# Altium project Laser-Cueing.PrjPcb
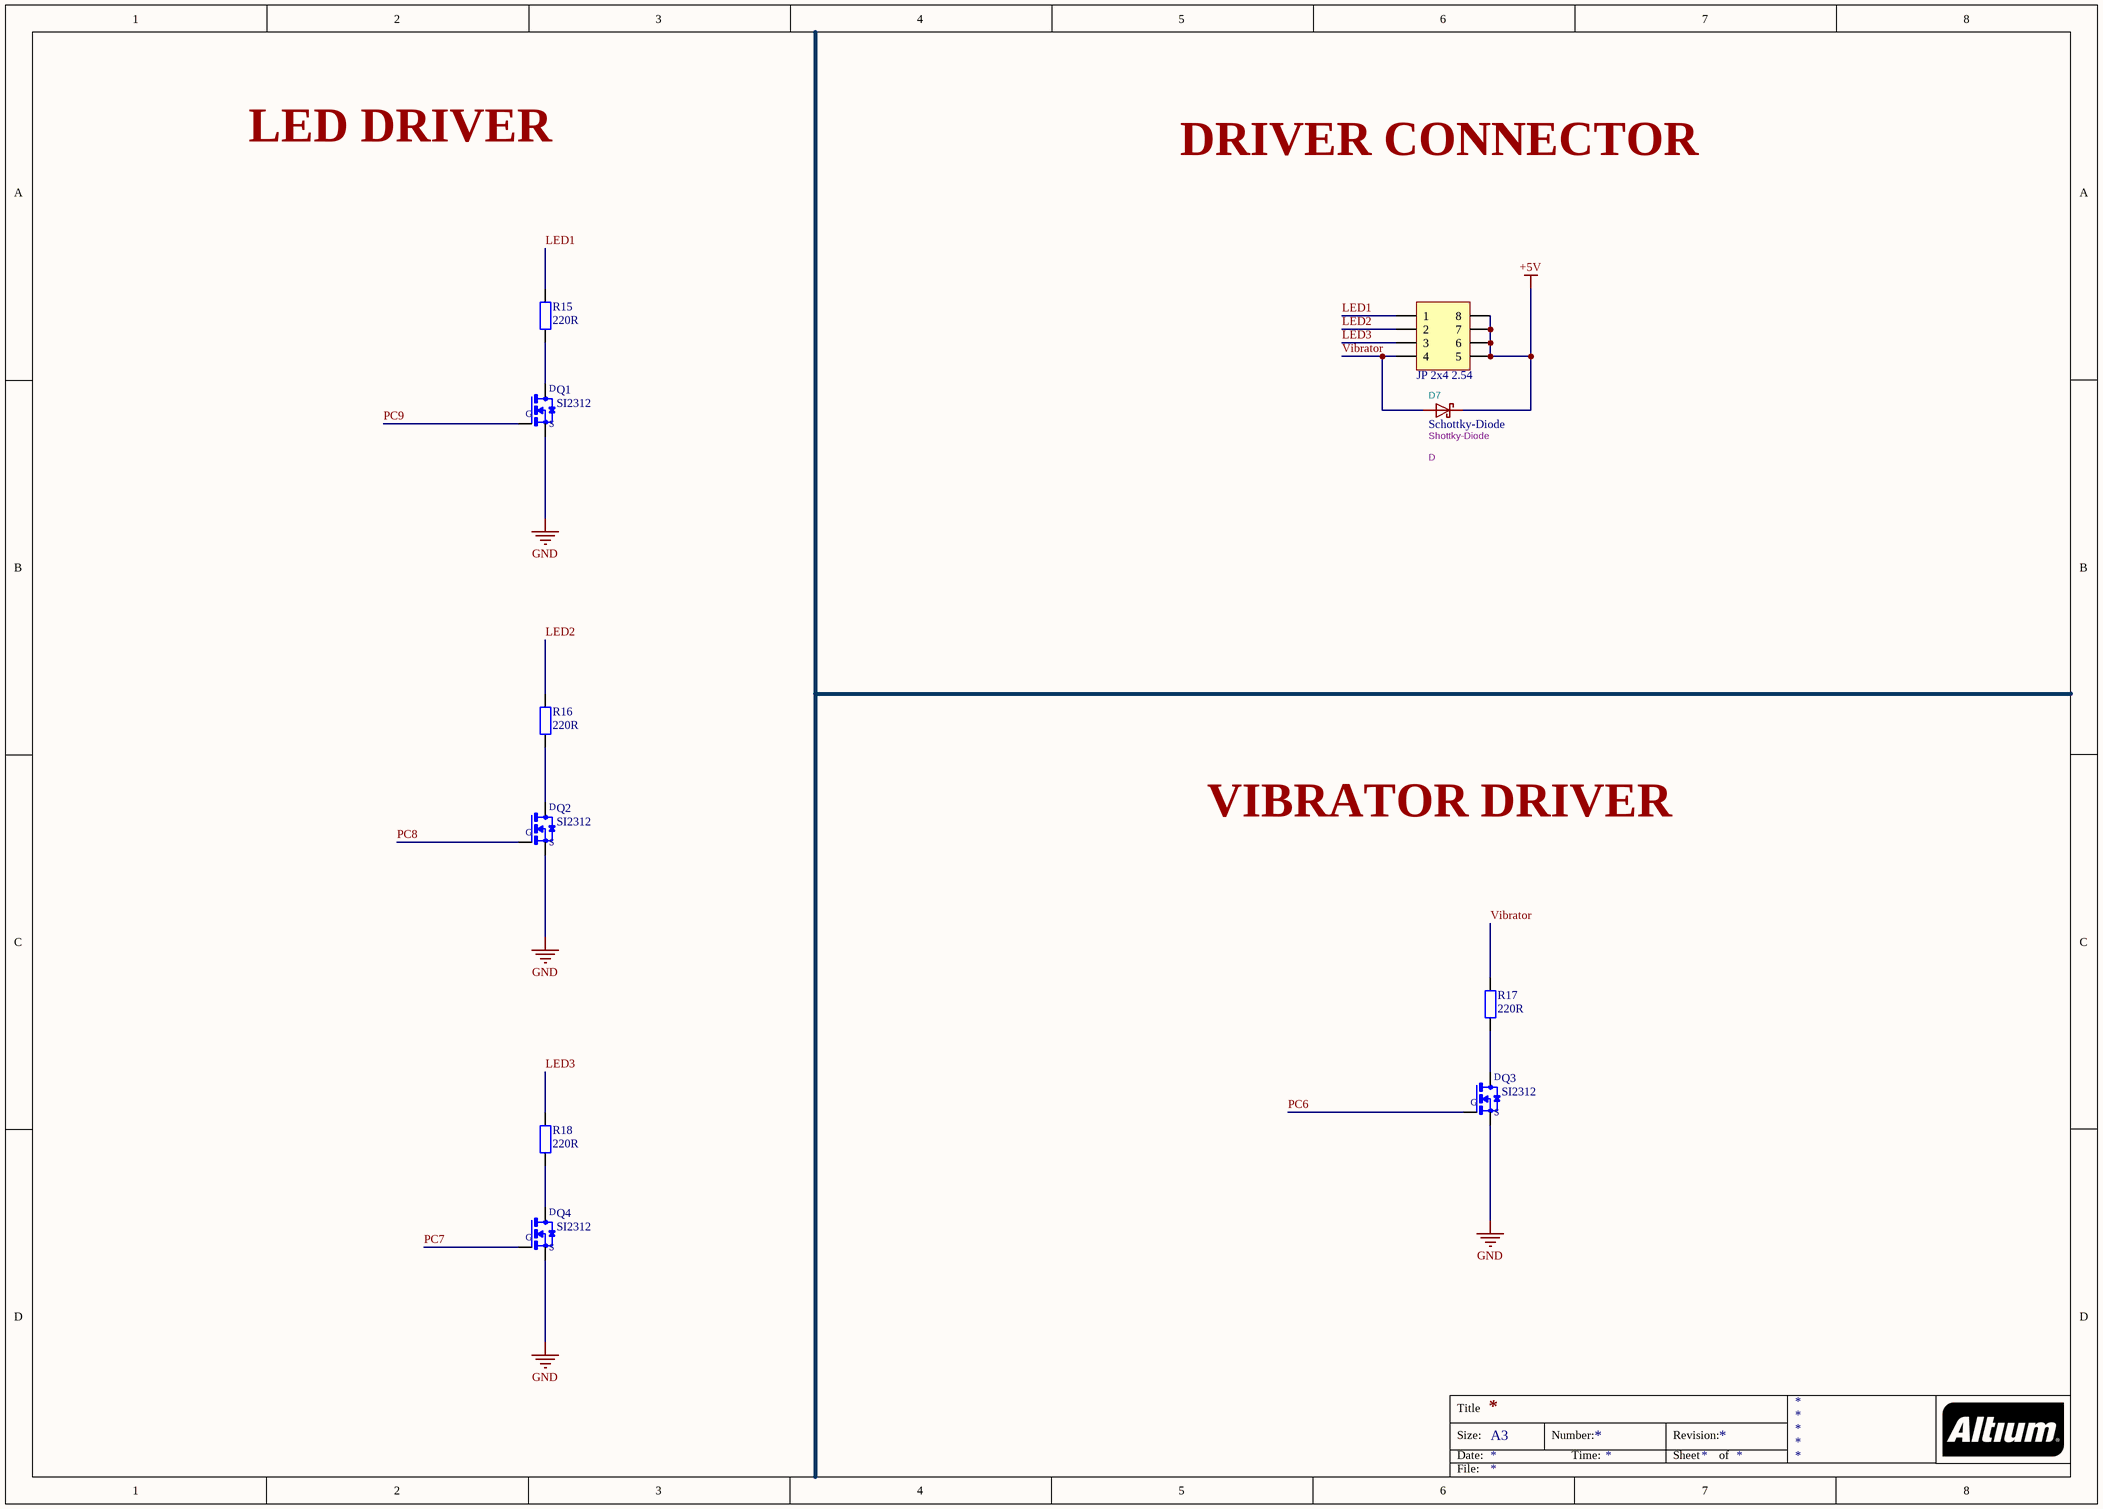
[diagram p0: Driver.SchDoc]
4 sheets, 63 parts. Net scope: global (net labels, ports and power ports of the same name join across sheets).
Board file: 06042024_LaserCueing.PcbDoc
Sheets:
  Driver.SchDoc
  ADC.SchDoc
  Peripherial.SchDoc
  PWR_SRC.SchDoc

## Sheet Driver.SchDoc
size A3

### Parts
D7  Schottky-Diode  value Shottky-Diode  Reference: D  [SOD-80_MiniMELF_Glass]
Driver1  JP 2x4 2.54  [JP 2x4 DT]
Q1  SI2312  [SOT23]
Q2  SI2312  [SOT23]
Q3  SI2312  [SOT23]
Q4  SI2312  [SOT23]
R15  220R  [tro smd 0603]
R16  220R  [tro smd 0603]
R17  220R  [tro smd 0603]
R18  220R  [tro smd 0603]

### Nets
+5V: D7.K Driver1.5 Driver1.6 Driver1.7 Driver1.8
GND: Q1.2(S) Q2.2(S) Q3.2(S) Q4.2(S)
LED1: Driver1.1 R15.2
LED2: Driver1.2 R16.2
LED3: Driver1.3 R18.2
PC6: Q3.1(G)
PC7: Q4.1(G)
PC8: Q2.1(G)
PC9: Q1.1(G)
Vibrator: D7.A Driver1.4 R17.2
NetQ1_3: Q1.3(D) R15.1
NetQ2_3: Q2.3(D) R16.1
NetQ3_3: Q3.3(D) R17.1
NetQ4_3: Q4.3(D) R18.1

### Notes on the sheet
- LED DRIVER
- DRIVER CONNECTOR
- VIBRATOR DRIVER
- Title
- Size:
- Date:
- A3
- Number:
- Time:
- Revision:
- Sheet
- of
- File:

### Library data of the parts
D7 = Schottky-Diode: ki_description: Schottky Diode; Datasheet: https://diotec.com/de/produktliste/SBD.html; ki_keywords: Schottky
Driver1 = JP 2x4 2.54 Duc Thang: Cắm; Ten_Linh_Kien: Jump Đôi Đực 2.54MM 2x40P Thẳng 11MM; Don_Vi: Con; Ma_Hang: MH002686; Ghi_Chu: *; Kieu_Chan: *; Chung_Loai: Cắm
Q1-Q4 = SI2312: <b>N-Channel MOSFET</b>    <a href="https://pricing.snapeda.com/parts/SI2312/Micro%20Commercial%20Components/view-part?ref=eda">Check availability</a> <a href="https://pricing.snapeda.com/parts/SI2312/Micro%20Commercial%20Components/view-part?ref=eda">Check availability</a>; MF: {'manufacturer': u'Micro Commercial Components'}; MP: SI2312-TP; Package: None; Price: None; Value: *; Availability: Unavailable
R15-R18 = Tro 0603 5% 220R: Dán; Don_Vi: Con; So_Chan: 2; Ten_Linh_Kien: Trở 0603 5% 220R; Ma_Hang: MH006322; Chung_Loai: Dán; Kieu_Chan: *

## Sheet ADC.SchDoc
size A4
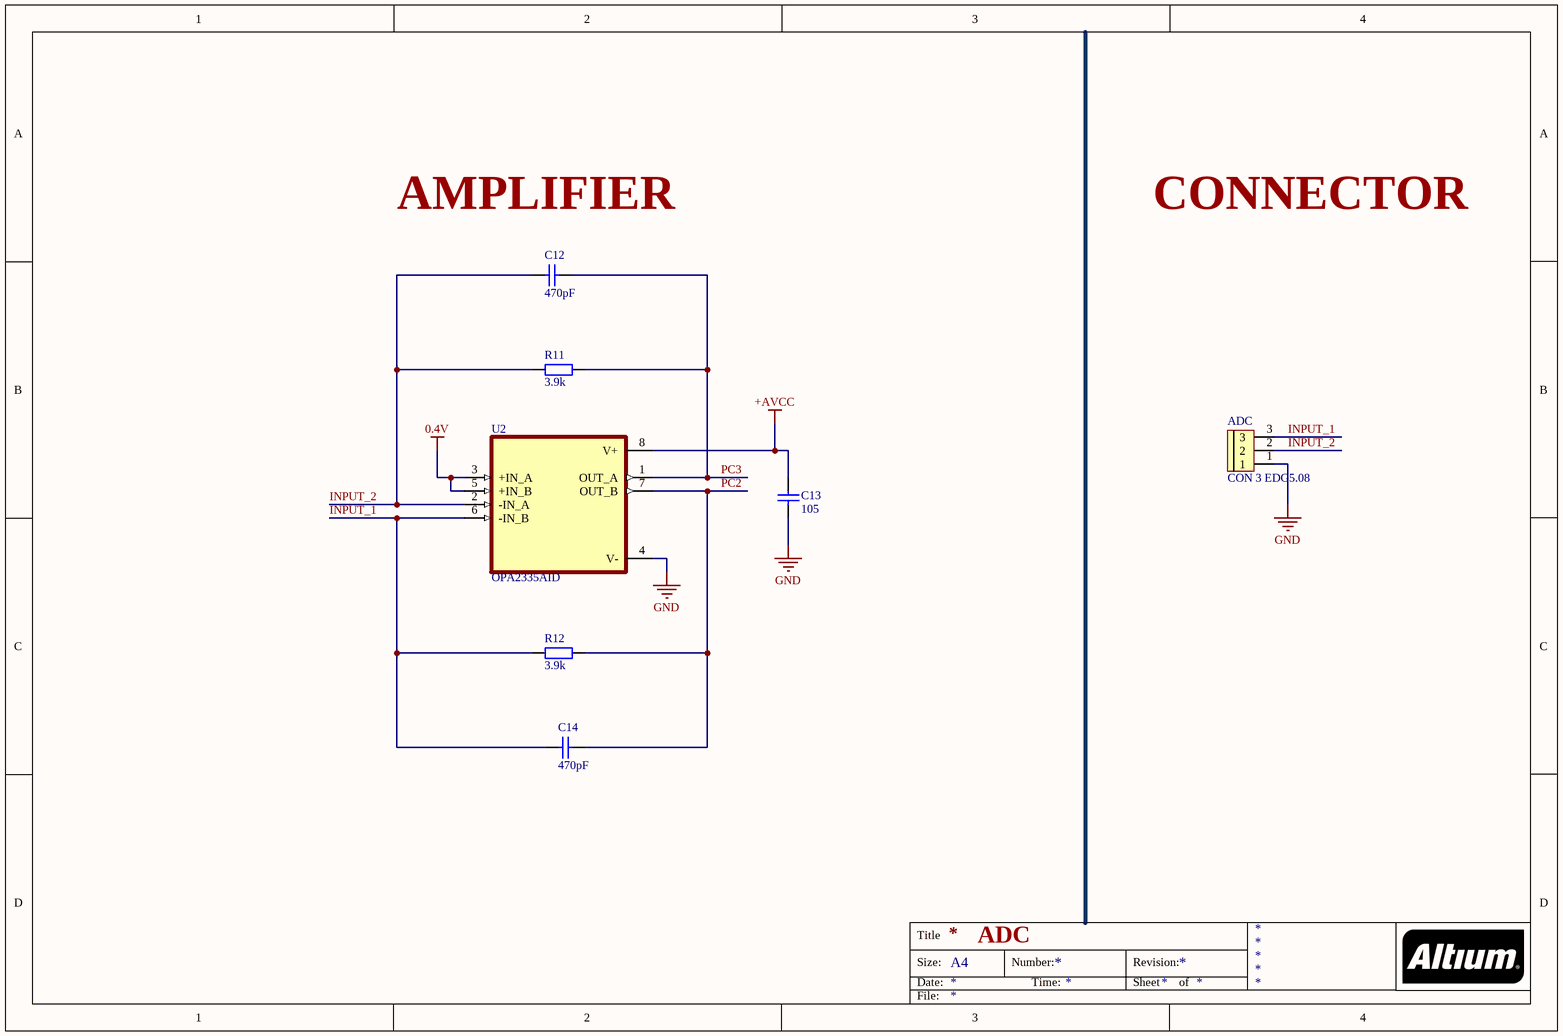
[diagram p1: ADC.SchDoc]

### Parts
ADC  CON 3 EDG5.08  [CON 3 3EDG5.08]
C12  470pF  [tu 0603]
C13  105  [tu 1206]
C14  470pF  [tu 0603]
R11  3.9k  [tro smd 0603]
R12  3.9k  [tro smd 0603]
U2  OPA2335AID  [SOIC127P599X175-8N]

### Nets
0.4V: U2.3(+IN_A) U2.5(+IN_B)
+AVCC: C13.1 U2.8(V+)
GND: ADC.1 C13.2 U2.4(V-)
INPUT_1: ADC.3 C14.2 R12.1 U2.6(-IN_B)
INPUT_2: ADC.2 C12.2 R11.1 U2.2(-IN_A)
PC2: C14.1 R12.2 U2.7(OUT_B)
PC3: C12.1 R11.2 U2.1(OUT_A)

### Notes on the sheet
- AMPLIFIER
- CONNECTOR
- ADC
- Title
- Size:
- Date:
- A4
- Number:
- Time:
- Revision:
- Sheet
- of
- File:

### Library data of the parts
ADC = CON 3 EDG5.08: Cắm; Ten_Linh_Kien: CON 3 2EDG5.08-3P 5.08MM ( Xanh Cong); Ma_Hang: MH000760; Ghi_Chu: *; Kieu_Chan: *; Don_Vi: Con; Chung_Loai: Cắm
C12 C14 = Tu 0603 470pF 50V 10%: Dán; Don_Vi: Con; So_Chan: 2; Ten_Linh_Kien: Tụ 0603 470P 50V 10%; Ma_Hang: MH004571; Chung_Loai: Dán; Kieu_Chan: *
C13 = Tu 1206 105 50V 20%: Dán; Don_Vi: Con; So_Chan: 2; Ten_Linh_Kien: Tụ 1206 105-1uF 20% 50V; Ma_Hang: MH004545; Chung_Loai: Dán; Kieu_Chan: *
R11 R12 = Tro 0603 1% 3.9k: Dán; So_Chan: 2; Ten_Linh_Kien: Trở 0603 1% 3.9k; Ma_Hang: MH005793; Don_Vi: Con; Chung_Loai: Dán; Kieu_Chan: *
U2 = OPA2335AID: MF: {'manufacturer': u'Texas Instruments'}; Package: None; Price: None; Value: *; MP: OPA2335AID; Availability: Unavailable

## Sheet Peripherial.SchDoc
size A3
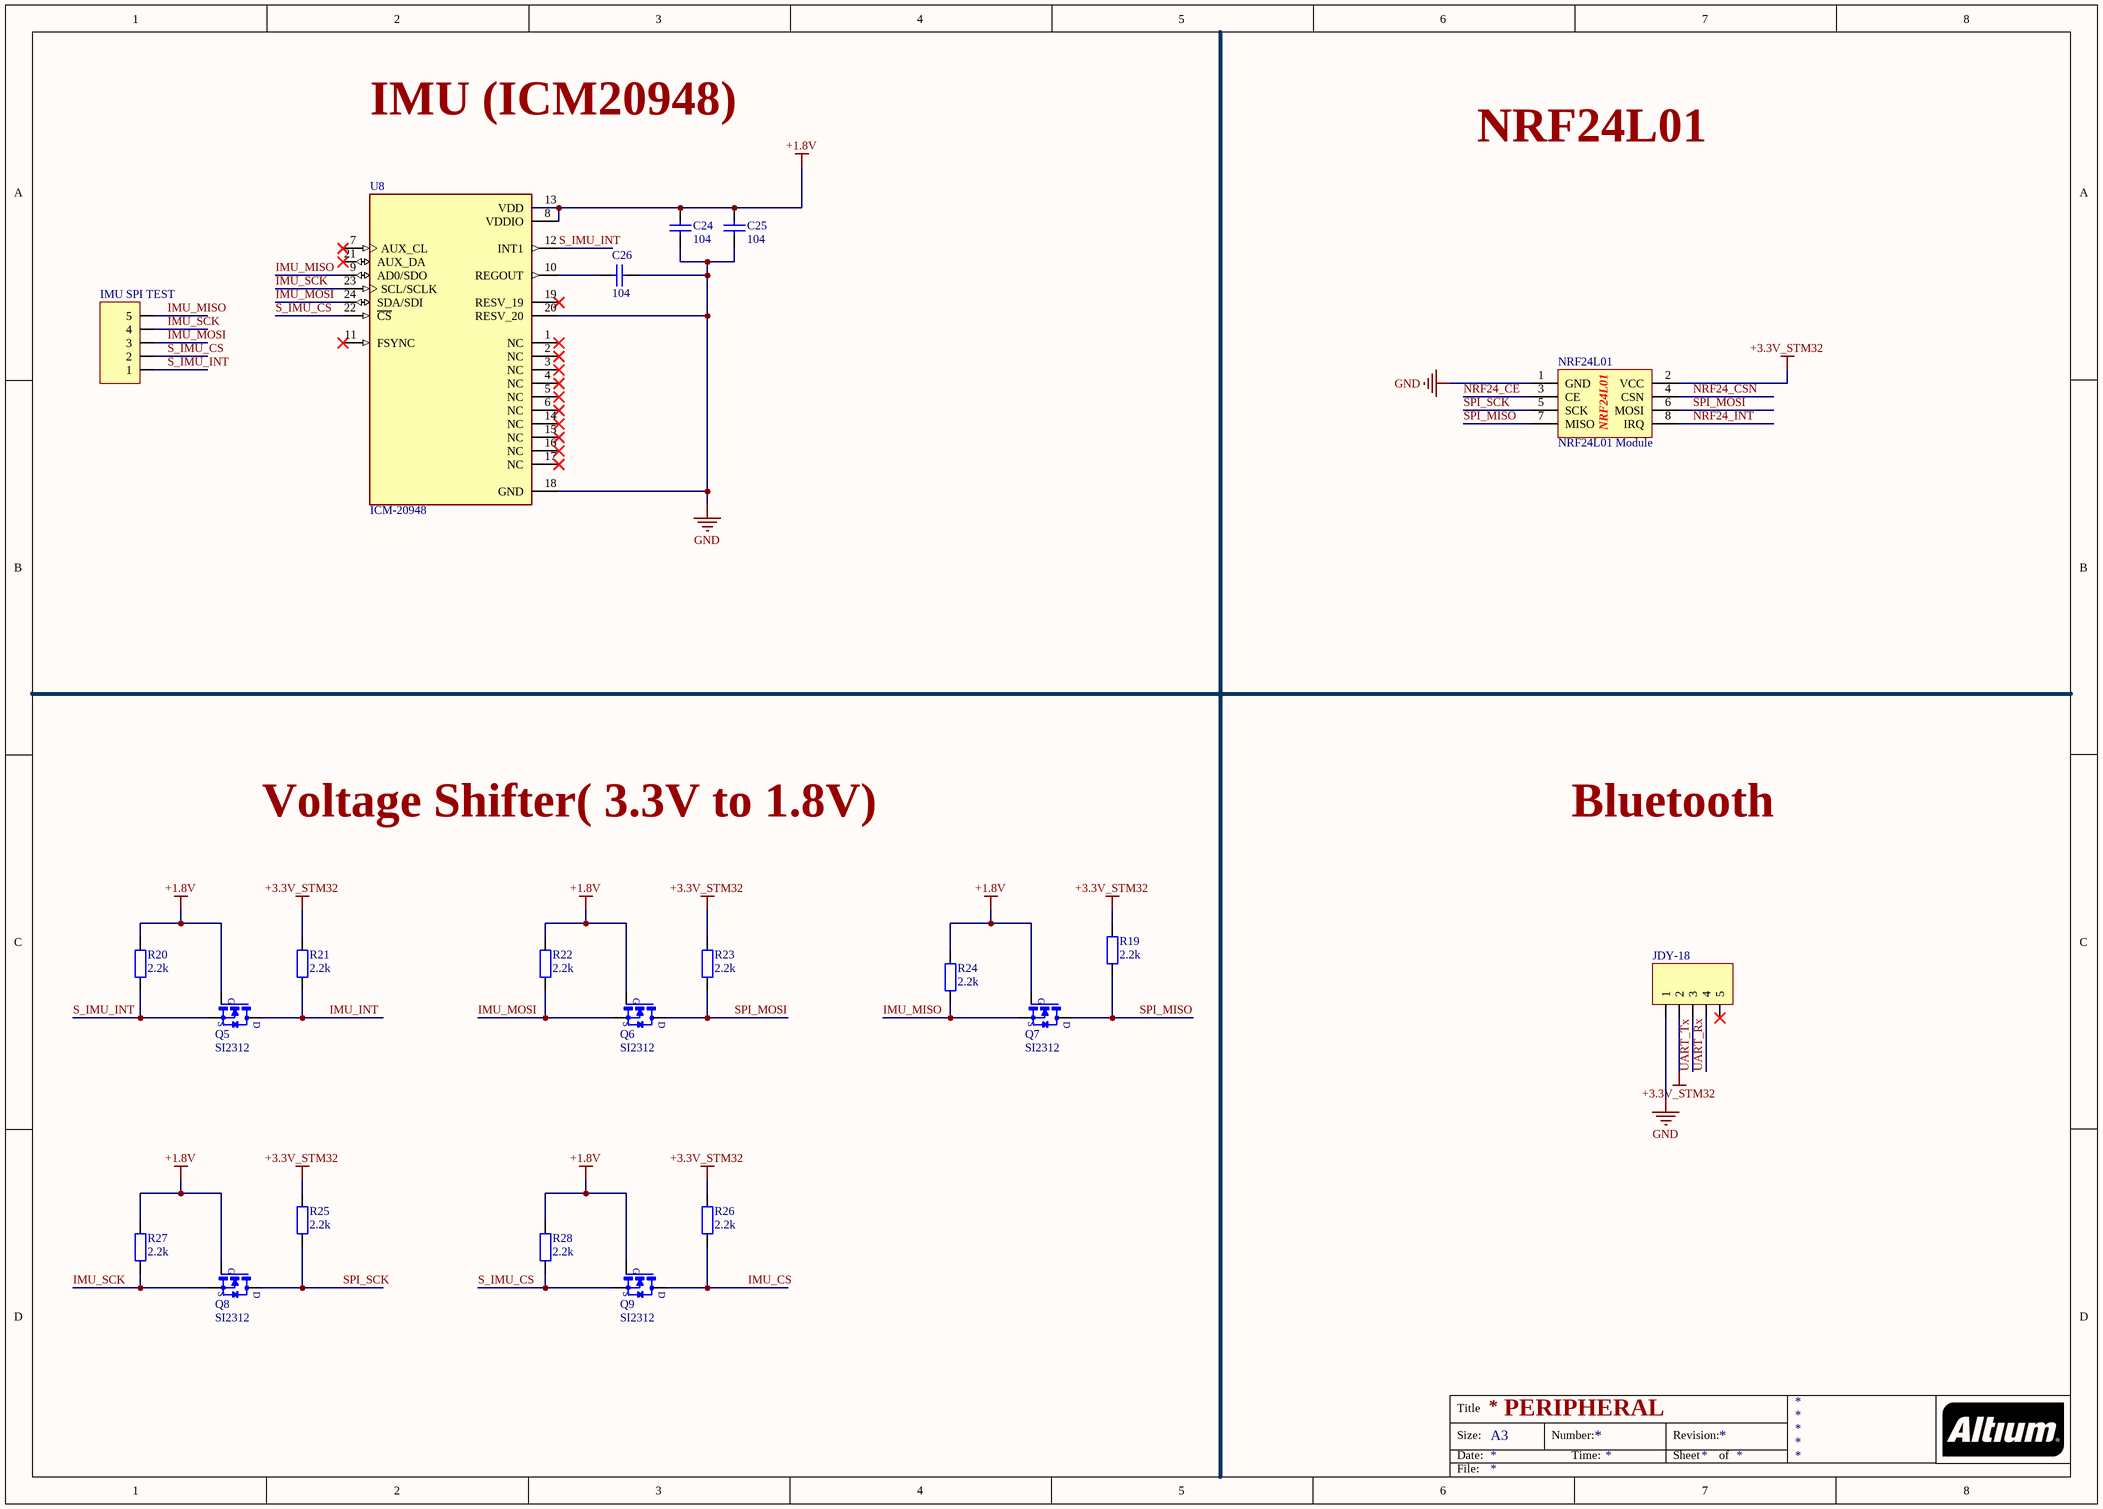
[diagram p2: Peripherial.SchDoc]

### Parts
C24  104  [tu 1206]
C25  104  [tu 1206]
C26  104  [tu 1206]
IMU_SPI_TEST  (no value)  [JP 1x5 DT]
JDY-18  JP 1x5 2.54  [JP 1x5 CC]  (value not drawn)
NRF24L01  NRF24L01 Module  [NRF24L01]
Q5  SI2312  [SOT23]
Q6  SI2312  [SOT23]
Q7  SI2312  [SOT23]
Q8  SI2312  [SOT23]
Q9  SI2312  [SOT23]
R19  2.2k  [tro smd 0603]
R20  2.2k  [tro smd 0603]
R21  2.2k  [tro smd 0603]
R22  2.2k  [tro smd 0603]
R23  2.2k  [tro smd 0603]
R24  2.2k  [tro smd 0603]
R25  2.2k  [tro smd 0603]
R26  2.2k  [tro smd 0603]
R27  2.2k  [tro smd 0603]
R28  2.2k  [tro smd 0603]
U8  ICM-20948  [QFN40P300X300X105-24N]

### Nets
+1.8V: C24.1 C25.1 Q5.1(G) Q6.1(G) Q7.1(G) Q8.1(G) Q9.1(G) R20.2 R22.2 R24.2 R27.2 R28.2 U8.8(VDDIO) U8.13(VDD)
+3.3V_STM32: JDY-18.2 NRF24L01.2(VCC) R19.2 R21.2 R23.2 R25.2 R26.2
GND: C24.2 C25.2 C26.2 JDY-18.1 NRF24L01.1(GND) U8.18(GND) U8.20(RESV_20)
IMU_CS: Q9.3(D) R26.1
IMU_INT: Q5.3(D) R21.1
IMU_MISO: IMU_SPI_TEST.5 Q7.2(S) R24.1 U8.9(AD0/SDO)
IMU_MOSI: IMU_SPI_TEST.3 Q6.2(S) R22.1 U8.24(SDA/SDI)
IMU_SCK: IMU_SPI_TEST.4 Q8.2(S) R27.1 U8.23(SCL/SCLK)
NRF24_CE: NRF24L01.3(CE)
NRF24_CSN: NRF24L01.4(CSN)
NRF24_INT: NRF24L01.8(IRQ)
S_IMU_CS: IMU_SPI_TEST.2 Q9.2(S) R28.1 U8.22(~{CS})
S_IMU_INT: IMU_SPI_TEST.1 Q5.2(S) R20.1 U8.12(INT1)
SPI_MISO: NRF24L01.7(MISO) Q7.3(D) R19.1
SPI_MOSI: NRF24L01.6(MOSI) Q6.3(D) R23.1
SPI_SCK: NRF24L01.5(SCK) Q8.3(D) R25.1
UART_Rx: JDY-18.4
UART_Tx: JDY-18.3
NetC26_1: C26.1 U8.10(REGOUT)

Not connected (* = marked no-connect by the designer): JDY-18 5*; U8 1(NC)* 2(NC)* 3(NC)* 4(NC)* 5(NC)* 6(NC)* 7(AUX_CL)* 11(FSYNC)* 14(NC)* 15(NC)* 16(NC)* 17(NC)* 19(RESV_19)* 21(AUX_DA)*

### Notes on the sheet
- IMU (ICM20948)
- NRF24L01
- Voltage Shifter( 3.3V to 1.8V)
- Bluetooth
- PERIPHERAL
- Title
- Size:
- Date:
- A3
- Number:
- Time:
- Revision:
- Sheet
- of
- File:

### Library data of the parts
C24-C26 = Tu 1206 104 50V 20%: Dán; Don_Vi: Con; So_Chan: 2; Ten_Linh_Kien: Tụ 1206 104-0.1uF 20% 50V; Ma_Hang: MH004544; Chung_Loai: Dán; Kieu_Chan: *
IMU_SPI_TEST = JP 1x5 2.54 Duc Thang: Cắm; Ten_Linh_Kien: Jump Đơn Đực 2.54MM 1x40P Thẳng 11MM; Don_Vi: Con; Ma_Hang: MH000903; Ghi_Chu: *; Kieu_Chan: *; Chung_Loai: Cắm
JDY-18 = JP 1x5 2.54 Cai Cong: Cắm; Ten_Linh_Kien: Jump Đơn Cái 2.54MM 1x40P Cong; Don_Vi: Con; Ma_Hang: MH001265; Ghi_Chu: *; Kieu_Chan: *; Chung_Loai: Cắm
Q5-Q9 = SI2312: as Q1 on sheet Driver; Package: None; Price: None; Value: *; Availability: Unavailable
R19-R28 = Tro 0603 5% 2.2k: Dán; Don_Vi: Con; So_Chan: 2; Ten_Linh_Kien: Trở 0603 5% 2.2k; Ma_Hang: MH006321; Chung_Loai: Dán; Kieu_Chan: *
U8 = ICM-20948: Accelerometer, Gyroscope, Magnetometer, 9 Axis Sensor IÂ²C, SPI Output; MF: {'manufacturer': u'TDK InvenSense'}; Package: None; Price: None; Value: *; MP: ICM-20948; Availability: Unavailable

## Sheet PWR_SRC.SchDoc
size A3
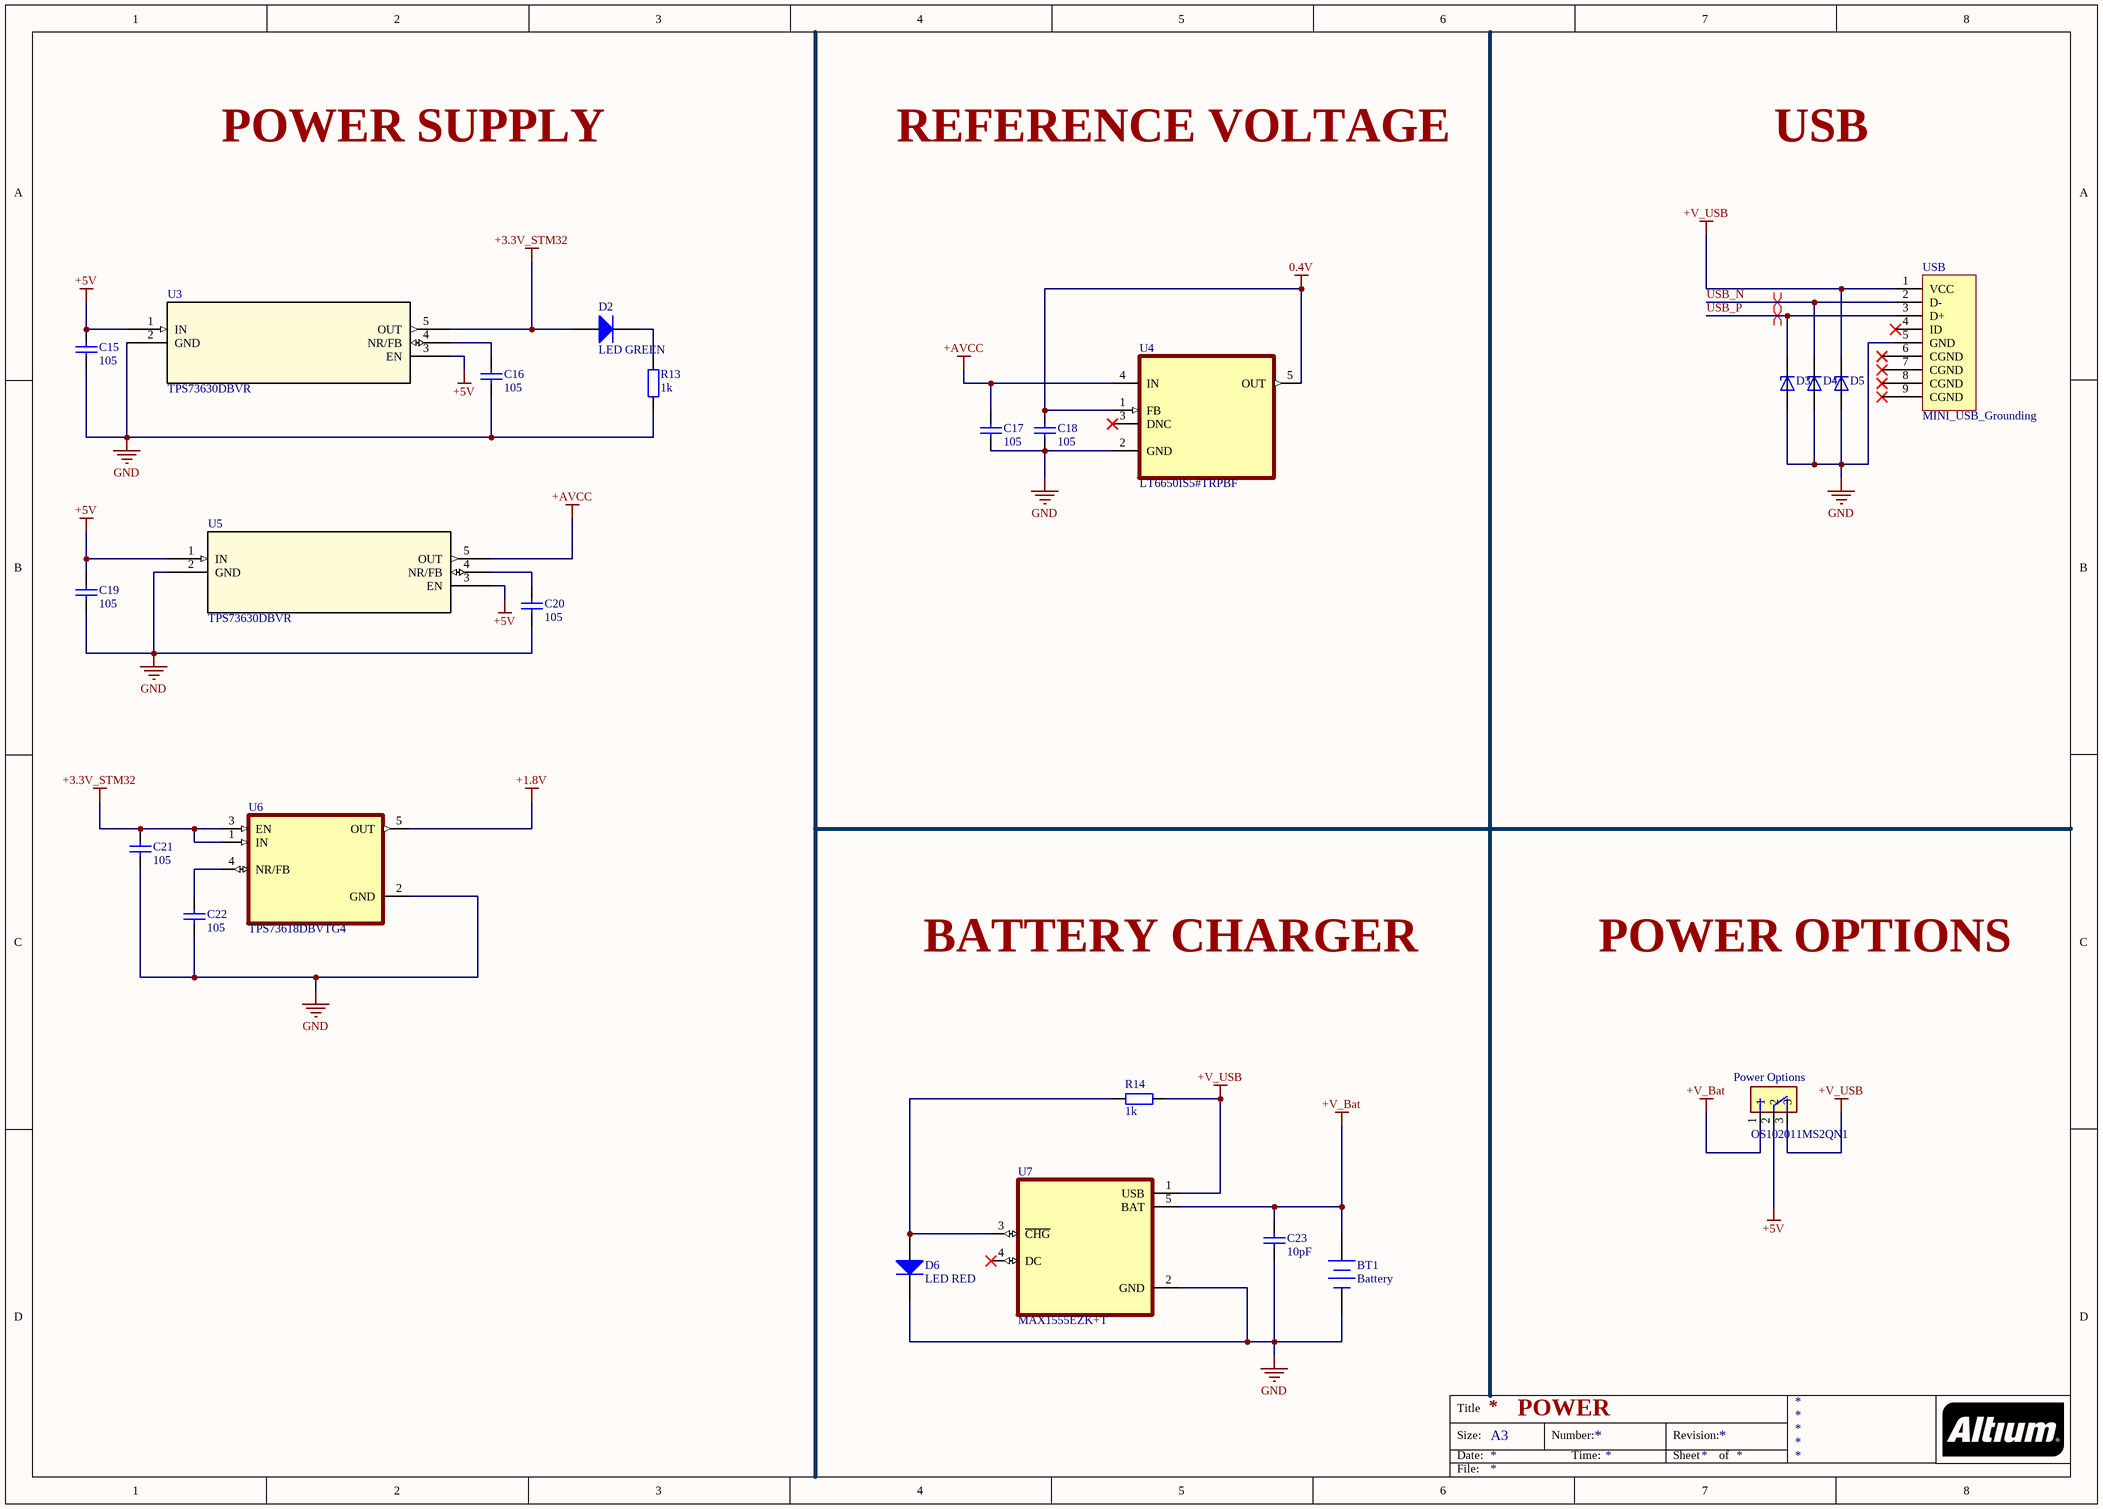
[diagram p3: PWR_SRC.SchDoc]

### Parts
BT1  Battery  [BAT-2]
C15  105  [tu 0603]
C16  105  [tu 0603]
C17  105  [tu 0603]
C18  105  [tu 0603]
C19  105  [tu 0603]
C20  105  [tu 0603]
C21  105  [tu 0603]
C22  105  [tu 0603]
C23  10pF  [tu 0805]
D2  LED GREEN  [J1-0603]
D3  AVRL161A1R1NTA  [TVS_AVRL161A1R1NTA]  (value not drawn)
D4  AVRL161A1R1NTA  [TVS_AVRL161A1R1NTA]  (value not drawn)
D5  AVRL161A1R1NTA  [TVS_AVRL161A1R1NTA]  (value not drawn)
D6  LED RED  [J1-0603]
Power_Options  OS102011MS2QN1  [SW_OS102011MS2QN1]
R13  1k  [tro smd 0603]
R14  1k  [tro smd 0603]
U3  TPS73630DBVR  [DBV5-M]
U4  LT6650IS5#TRPBF  [SOT95P280X100-5N]
U5  TPS73630DBVR  [DBV5-M]
U6  TPS73618DBVTG4  [SOT95P280X145-5N]
U7  MAX1555EZK+T  [SOT95P275X110-5N]
USB  MINI_USB_Grounding  [micro_USB shilding]

### Nets
0.4V: C18.1 U4.1(FB) U4.5(OUT)
+1.8V: U6.5(OUT)
+3.3V_STM32: C21.1 D2.1(A) U3.5(OUT) U6.1(IN) U6.3(EN)
+5V: C15.1 C19.1 Power_Options.2 U3.1(IN) U3.3(EN) U5.1(IN) U5.3(EN)
+AVCC: C17.1 U4.4(IN) U5.5(OUT)
+V_Bat: BT1.1(+) C23.1 Power_Options.1 U7.5(BAT)
+V_USB: D5.1(C) Power_Options.3 R14.2 U7.1(USB) USB.1(VCC)
GND: BT1.2(-) C15.2 C16.2 C17.2 C18.2 C19.2 C20.2 C21.2 C22.2 C23.2 D3.2(A) D4.2(A) D5.2(A) D6.2(K) R13.2 U3.2(GND) U4.2(GND) U5.2(GND) U6.2(GND) U7.2(GND) USB.5(GND)
USB_N: D4.1(C) USB.2(D-)
USB_P: D3.1(C) USB.3(D+)
NetC16_1: C16.1 U3.4(NR/FB)
NetC20_1: C20.1 U5.4(NR/FB)
NetC22_1: C22.1 U6.4(NR/FB)
NetD2_2: D2.2(K) R13.1
NetD6_1: D6.1(A) R14.1 U7.3(~{CHG})

Not connected (* = marked no-connect by the designer): U4 3(DNC)*; U7 4(DC)*; USB 4(ID)* 6(CGND)* 7(CGND)* 8(CGND)* 9(CGND)*

### Layout directives
differential pair; differential pair class diff90: USB_N, USB_P

### Notes on the sheet
- POWER SUPPLY
- REFERENCE VOLTAGE
- USB
- BATTERY CHARGER
- POWER OPTIONS
- POWER
- Title
- Size:
- Date:
- A3
- Number:
- Time:
- Revision:
- Sheet
- of
- File:

### Library data of the parts
BT1 = Battery: Multicell Battery; Published: 24-Mar-1999; LatestRevisionDate: 17-Jul-2002; LatestRevisionNote: Re-released for DXP Platform.; PackageReference: BAT-2; Publisher: Altium Limited; PackageDescription: Battery; 2 Leads
C15-C22 = Tu 0603 105 16V 20%: Dán; Don_Vi: Con; So_Chan: 2; Ten_Linh_Kien: Tụ 0603 105-1uF 20% 16V; Ma_Hang: MH004574; Chung_Loai: Dán; Kieu_Chan: *
C23 = Tu 0805 10pF 50V 10%: Dán; Don_Vi: Con; So_Chan: 2; Ten_Linh_Kien: Tụ 0805 10P 10% 50V; Ma_Hang: MH004554; Chung_Loai: Dán; Kieu_Chan: *
D2 D6 = Diode: Default Diode; Published: 8-Jun-2000; LatestRevisionDate: 17-Jul-2002; LatestRevisionNote: Re-released for DXP Platform.; PackageDocument: Sep-1996; PackageReference: SMC; Publisher: Altium Limited; Code_JEDEC: DO-214-AB
D3-D5 = AVRL161A1R1NTA: MF: {'manufacturer': u'TDK'}; Package: None; Price: None; Value: *; MP: AVRL161A1R1NTA; Availability: Unavailable
Power_Options = OS102011MS2QN1: Switch Slide ON ON SPDT Top Slide 0.1A 12VDC 10000Cycles PC Pins Thru-Hole Bulk; MF: {'manufacturer': u'C&K'}; Package: None; Price: None; Value: *; MP: OS102011MS2QN1; Availability: Unavailable
R13 = Tro 0603 5% 1k: Dán; Don_Vi: Con; So_Chan: 2; Ten_Linh_Kien: Trở 0603 5% 1k; Ma_Hang: MH006319; Chung_Loai: Dán; Kieu_Chan: *
R14 = Tro 0603 1% 1k: Dán; So_Chan: 2; Don_Vi: Con; Ten_Linh_Kien: Trở 0603 1% 1k; Ma_Hang: MH006334; Chung_Loai: Dán; Kieu_Chan: *
U3 U5 = TPS73630DBVR: No Description Available; Mfr_Name: Texas Instruments; RefDes: RefDes; Type: Type
U4 = LT6650IS5#TRPBF: Micropower, 400mV Reference with Rail-to-Rail Buffer Amplifier; MF: {'manufacturer': u'Analog Devices'}; Package: None; Price: None; Value: *; MP: LT6650IS5#TRPBF; Availability: Unavailable
U6 = TPS73618DBVTG4: MF: {'manufacturer': u'Texas Instruments'}; Package: None; Price: None; Value: *; MP: TPS73618DBVTG4; Availability: Unavailable
U7 = MAX1555EZK+T: MF: {'manufacturer': u'Analog Devices'}; Package: None; Price: None; Value: *; MP: MAX1555EZK+; Availability: Unavailable

## Nets that join several sheets
0.4V: ADC (U2.3 U2.5), PWR_SRC (C18.1 U4.1 U4.5)
+1.8V: Peripherial (14 pins), PWR_SRC (U6.5)
+3.3V_STM32: Peripherial (7 pins), PWR_SRC (5 pins)
+5V: Driver (5 pins), PWR_SRC (7 pins)
+AVCC: ADC (C13.1 U2.8), PWR_SRC (C17.1 U4.4 U5.5)
GND: Driver (Q1.2 Q2.2 Q3.2 Q4.2), ADC (ADC.1 C13.2 U2.4), Peripherial (7 pins), PWR_SRC (21 pins)